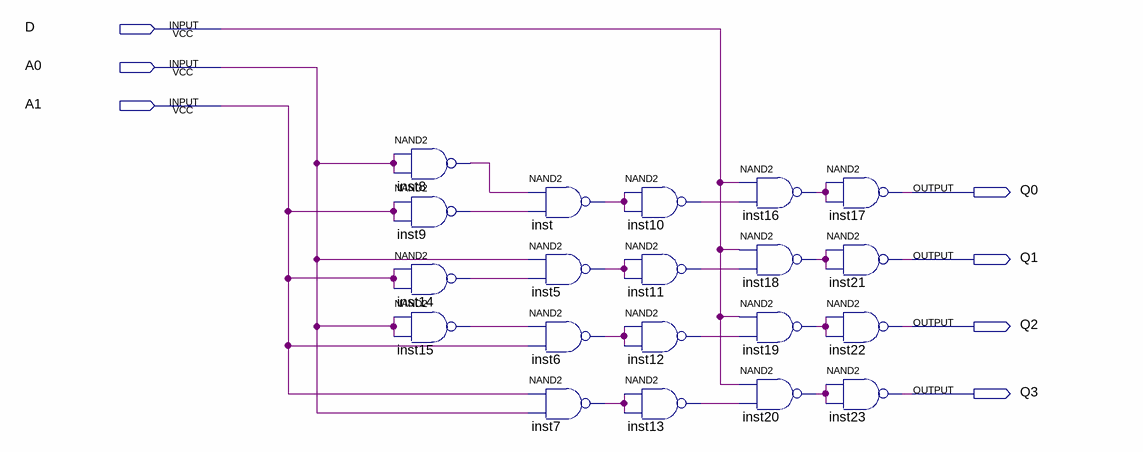
[diagram p0: schematic sheet]
// Quartus schematic DMX_2_address_input_2nand.bdf as structural Verilog: 20 symbols, 7 pins
module DMX_2_address_input_2nand (
  input  D,
  input  A0,
  input  A1,
  output Q0,
  output Q1,
  output Q2,
  output Q3
);

  wire inst5_out, inst6_out, inst7_out, inst8_out, inst9_out, inst10_out, inst11_out, inst12_out, inst13_out,
       inst14_out, inst15_out, inst16_out, inst18_out, inst19_out, inst20_out, inst_out;

  nand inst8 (inst8_out, A0, A0);
  nand inst9 (inst9_out, A1, A1);
  nand inst14 (inst14_out, A1, A1);
  nand inst15 (inst15_out, A0, A0);
  nand inst (inst_out, inst8_out, inst9_out);
  nand inst5 (inst5_out, A0, inst14_out);
  nand inst6 (inst6_out, inst15_out, A1);
  nand inst7 (inst7_out, A1, A0);
  nand inst10 (inst10_out, inst_out, inst_out);
  nand inst11 (inst11_out, inst5_out, inst5_out);
  nand inst12 (inst12_out, inst6_out, inst6_out);
  nand inst13 (inst13_out, inst7_out, inst7_out);
  nand inst16 (inst16_out, D, inst10_out);
  nand inst18 (inst18_out, D, inst11_out);
  nand inst19 (inst19_out, D, inst12_out);
  nand inst20 (inst20_out, D, inst13_out);
  nand inst17 (Q0, inst16_out, inst16_out);
  nand inst21 (Q1, inst18_out, inst18_out);
  nand inst22 (Q2, inst19_out, inst19_out);
  nand inst23 (Q3, inst20_out, inst20_out);
endmodule
